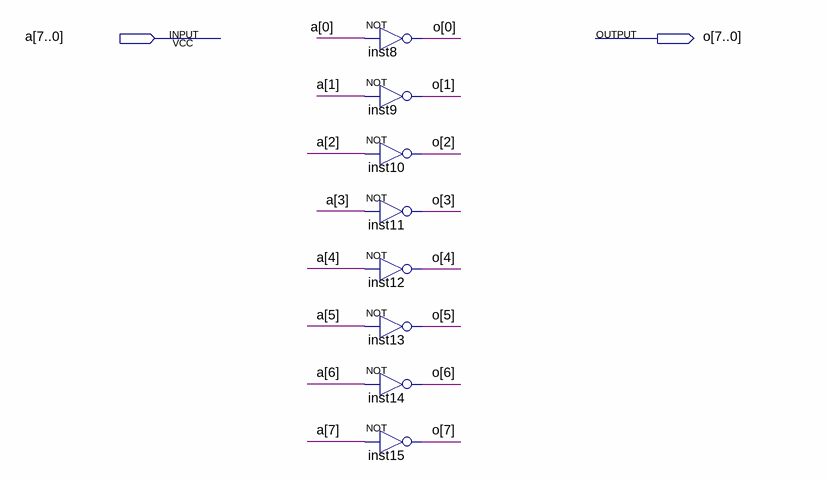
[diagram p0: schematic sheet]
// Quartus schematic 8bitnot.bdf as structural Verilog: 8 symbols, 2 pins
module \8bitnot  (
  input  [7:0] a,
  output [7:0] o
);

  not inst8 (o[0], a[0]);
  not inst9 (o[1], a[1]);
  not inst10 (o[2], a[2]);
  not inst11 (o[3], a[3]);
  not inst12 (o[4], a[4]);
  not inst13 (o[5], a[5]);
  not inst14 (o[6], a[6]);
  not inst15 (o[7], a[7]);
endmodule
